# Altium schematic sheet Rele_RF_2canals_MCT.SchDoc
size 594 x 420 mm; Author: Казаков; PageSetup: Record=PageOptions|CenterHorizontal=True|CenterVertical=True|PrintScale=0.76|XCorrection=1.00|YCorrection=1.00|PrintKind=2|BorderSize=5000000|LeftOffset=0|BottomOffset=0|Orientation=2|PaperLength=1000|PaperWidth=1000|Scale=100|PaperSource=1|PrintQuality=600|MediaType=1|DitherType=10|PaperKind=A3|PrintScaleMode=1
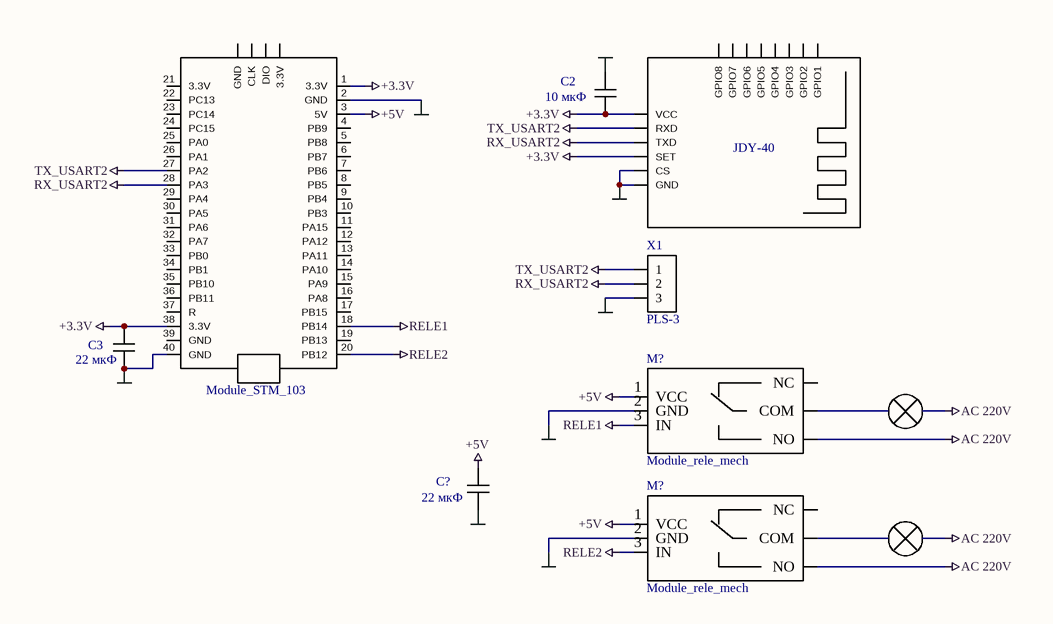
[diagram p0: Rele_RF_2canals_MCT.SchDoc]

## Parts
(Parts that share a designator on the sheet are numbered #1, #2 ... from top to bottom, then left to right.)
*#1  Module_STM_103
*#2  JDY-40
C2  10 мкФ  [1210C]
C3  22 мкФ  [1210C]
C?  22 мкФ  [0603C]
M?#1  Module_rele_mech
M?#2  Module_rele_mech
X1  PLS-3  [PLS_3]

## Nets
+3.3V: *#1.1(3.3V) *#1.38(3.3V) *#2.9(VCC) *#2.12(SET) C2.1 C3.2
+5V: *#1.3(5V) C?.2 M?#1.1(VCC) M?#2.1(VCC)
AC 220V: M?#1.6(NO) M?#2.6(NO)
GND: *#1.2(GND) *#1.40(GND) *#2.13(CS) *#2.14(GND) C2.2 C3.1 C?.1 M?#1.2(GND) M?#2.2(GND) X1.3
RELE1: *#1.18(PB14) M?#1.3(IN)
RELE2: *#1.20(PB12) M?#2.3(IN)
RX_USART2: *#1.28(PA3) *#2.11(TXD) X1.2
TX_USART2: *#1.27(PA2) *#2.10(RXD) X1.1

Not connected (* = marked no-connect by the designer): *#1 4(PB9) 5(PB8) 6(PB7) 7(PB6) 8(PB5) 9(PB4) 10(PB3) 11(PA15) 12(PA12) 13(PA11) 14(PA10) 15(PA9) 16(PA8) 17(PB15) 19(PB13) 21(3.3V) 22(PC13) 23(PC14) 24(PC15) 25(PA0) 26(PA1) 29(PA4) 30(PA5) 31(PA6) 32(PA7) 33(PB0) 34(PB1) 35(PB10) 36(PB11) 37(R) 39(GND); *#2 1(GPIO1) 2(GPIO2) 3(GPIO3) 4(GPIO4) 5(GPIO5) 6(GPIO6) 7(GPIO7) 8(GPIO8); M?#1 4(NC) 5(COM); M?#2 4(NC) 5(COM)

## Notes on the sheet
- Подп. и дата
- Инв. № дубл.
- Взам. инв. №
- Изм.
- Разраб.
- Лист
- № Докум.
- Подп.
- Дата
- Лит.
- Масса
- Масштаб
- Т. контр.
- Проверил
- Листов
- Инв. № подл.
- Утв.
- Н. контр.
- Копировал
- Формат А2

## Library data of the parts
C2 C3 C? = Capacitor
  C2: Value: 10 мкФ
  C3 C?: Value: 22 мкФ
X1 = CONT_3